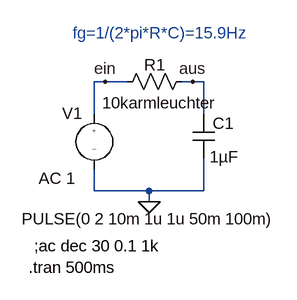
[diagram p0: schematic tiefpass.asc]
tiefpass.asc, the LTspice schematic file:
Version 4
SHEET 1 880 680
WIRE 112 96 96 96
WIRE 144 96 112 96
WIRE 240 96 224 96
WIRE 256 96 240 96
WIRE 96 144 96 96
WIRE 256 144 256 96
WIRE 96 256 96 224
WIRE 176 256 96 256
WIRE 256 256 256 208
WIRE 256 256 176 256
WIRE 176 272 176 256
FLAG 240 96 aus
FLAG 112 96 ein
FLAG 176 272 0
SYMBOL res 128 112 R270
WINDOW 0 25 56 VTop 2
WINDOW 3 1 63 VBottom 2
SYMATTR InstName R1
SYMATTR Value 10karmleuchter
SYMBOL cap 240 144 R0
WINDOW 0 29 13 Left 2
WINDOW 3 25 62 Left 2
SYMATTR InstName C1
SYMATTR Value 1µF
SYMBOL source-V 96 128 M0
WINDOW 0 18 14 Left 2
WINDOW 123 28 109 Left 2
WINDOW 39 0 0 Left 2
WINDOW 3 -265 169 Left 2
SYMATTR InstName V1
SYMATTR Value2 AC 1
SYMATTR Value PULSE(0 2 10m 1u 1u 50m 100m)
TEXT 64 24 Left 2 ;fg=1/(2*pi*R*C)=15.9Hz
TEXT 8 336 Left 2 !;ac dec 30 0.1 1k
TEXT 0 368 Left 2 !.tran 500ms

The netlist it stands for:
* tiefpass.asc
R1 ein aus 10karmleuchter
C1 aus 0 1µF
V1 ein 0 PULSE(0 2 10m 1u 1u 50m 100m) AC 1
* fg=1/(2*pi*R*C)=15.9Hz
;ac dec 30 0.1 1k
.tran 500ms
.backanno
.end